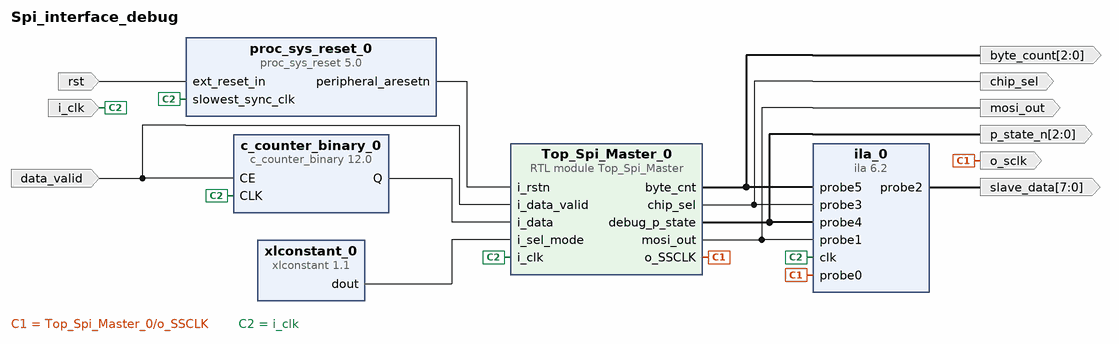
[diagram p0: block diagram of the top level]
# Vivado block design Spi_interface_debug, xc7a35tftg256-1, Vivado 2022.2
create_bd_design Spi_interface_debug

create_bd_port -dir I -type clk i_clk
create_bd_port -dir I data_valid
create_bd_port -dir I -type rst rst
create_bd_port -dir O -type data o_sclk
create_bd_port -dir O -from 2 -to 0 -type data byte_count
create_bd_port -dir O -type data chip_sel
create_bd_port -dir O -from 2 -to 0 -type data p_state_n
create_bd_port -dir O -type data mosi_out
create_bd_port -dir O -from 7 -to 0 -type data slave_data

create_bd_cell -type ip -vlnv xilinx.com:ip:c_counter_binary:12.0 c_counter_binary_0
set_property -dict {CONFIG.CE true CONFIG.Increment_Value 8 CONFIG.Output_Width 8} [get_bd_cells c_counter_binary_0]
create_bd_cell -type ip -vlnv xilinx.com:ip:xlconstant:1.1 xlconstant_0
set_property -dict {CONFIG.CONST_VAL 0} [get_bd_cells xlconstant_0]
create_bd_cell -type ip -vlnv xilinx.com:ip:ila:6.2 ila_0
set_property -dict [list \
  CONFIG.C_DATA_DEPTH 4096 \
  CONFIG.C_EN_STRG_QUAL 1 \
  CONFIG.C_MONITOR_TYPE Native \
  CONFIG.C_NUM_OF_PROBES 6 \
  CONFIG.C_PROBE0_TYPE 1 \
  CONFIG.C_PROBE1_TYPE 1 \
  CONFIG.C_PROBE2_TYPE 1 \
  CONFIG.C_PROBE2_WIDTH 8 \
  CONFIG.C_PROBE4_TYPE 1 \
  CONFIG.C_PROBE4_WIDTH 3 \
  CONFIG.C_PROBE5_TYPE 1 \
  CONFIG.C_PROBE5_WIDTH 3 \
  CONFIG.C_TRIGIN_EN false \
] [get_bd_cells ila_0]
create_bd_cell -type ip -vlnv xilinx.com:ip:proc_sys_reset:5.0 proc_sys_reset_0
create_bd_cell -type module -reference Top_Spi_Master Top_Spi_Master_0

# ---- connections ----

connect_bd_net [get_bd_pins Top_Spi_Master_0/byte_cnt] [get_bd_pins ila_0/probe5] [get_bd_ports byte_count]
connect_bd_net [get_bd_pins Top_Spi_Master_0/chip_sel] [get_bd_pins ila_0/probe3] [get_bd_ports chip_sel]
connect_bd_net [get_bd_pins Top_Spi_Master_0/debug_p_state] [get_bd_pins ila_0/probe4] [get_bd_ports p_state_n]
connect_bd_net [get_bd_pins Top_Spi_Master_0/mosi_out] [get_bd_pins ila_0/probe1] [get_bd_ports mosi_out]
connect_bd_net [get_bd_pins Top_Spi_Master_0/o_SSCLK] [get_bd_pins ila_0/probe0] [get_bd_ports o_sclk]
connect_bd_net -net Top_Spi_Master_0_slave_data_out [get_bd_pins ila_0/probe2] [get_bd_ports slave_data]
connect_bd_net [get_bd_pins c_counter_binary_0/Q] [get_bd_pins Top_Spi_Master_0/i_data]
connect_bd_net -net clk_wiz_0_clk_out1 [get_bd_ports i_clk] \
  [get_bd_pins ila_0/clk] [get_bd_pins c_counter_binary_0/CLK] [get_bd_pins proc_sys_reset_0/slowest_sync_clk] \
  [get_bd_pins Top_Spi_Master_0/i_clk]
connect_bd_net -net i_data_valid_0_1 [get_bd_ports data_valid] [get_bd_pins c_counter_binary_0/CE] [get_bd_pins Top_Spi_Master_0/i_data_valid]
connect_bd_net [get_bd_pins proc_sys_reset_0/peripheral_aresetn] [get_bd_pins Top_Spi_Master_0/i_rstn]
connect_bd_net -net resetn_0_1 [get_bd_ports rst] [get_bd_pins proc_sys_reset_0/ext_reset_in]
connect_bd_net [get_bd_pins xlconstant_0/dout] [get_bd_pins Top_Spi_Master_0/i_sel_mode]

validate_bd_design
save_bd_design
